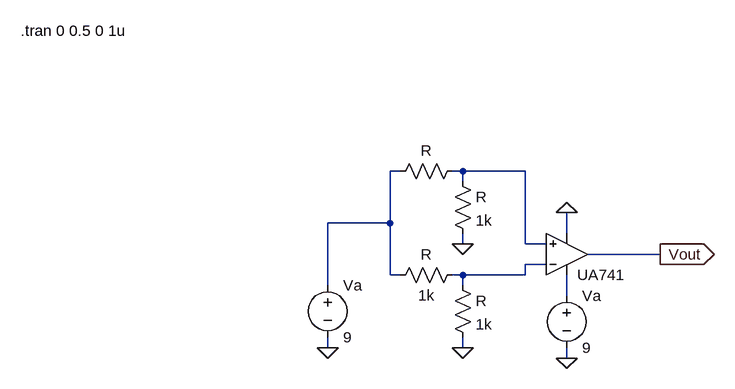
[diagram p0: schematic progetto_rete_termistore.asc]
progetto_rete_termistore.asc, the LTspice schematic file:
Version 4
SHEET 1 880 680
WIRE 32 96 16 96
WIRE 128 96 112 96
WIRE 224 96 128 96
WIRE 128 112 128 96
WIRE 16 176 16 96
WIRE 16 176 -80 176
WIRE 288 192 288 160
WIRE 128 208 128 192
WIRE 224 208 224 96
WIRE 256 208 224 208
WIRE 432 224 320 224
WIRE 256 240 224 240
WIRE 16 256 16 176
WIRE 32 256 16 256
WIRE 128 256 112 256
WIRE 224 256 224 240
WIRE 224 256 128 256
WIRE -80 272 -80 176
WIRE 128 272 128 256
WIRE 288 288 288 256
WIRE -80 368 -80 352
WIRE 128 368 128 352
WIRE 288 384 288 368
FLAG -80 368 0
FLAG 128 368 0
FLAG 128 208 0
FLAG 288 384 0
FLAG 288 160 0
FLAG 432 224 Vout
IOPIN 432 224 Out
SYMBOL res 128 80 R90
WINDOW 0 0 56 VBottom 2
WINDOW 3 32 56 VTop 2
SYMATTR InstName R
SYMATTR Value ""
SYMBOL res 112 96 R0
SYMATTR InstName R
SYMATTR Value 1k
SYMBOL res 112 256 R0
SYMATTR InstName R
SYMATTR Value 1k
SYMBOL res 128 240 R90
WINDOW 0 0 56 VBottom 2
WINDOW 3 32 56 VTop 2
SYMATTR InstName R
SYMATTR Value 1k
SYMBOL OpAmps\\UniversalOpAmp2 288 224 M180
SYMATTR InstName UA741
SYMBOL voltage 288 272 R0
WINDOW 123 0 0 Left 0
WINDOW 39 0 0 Left 0
SYMATTR InstName Va
SYMATTR Value 9
SYMBOL voltage -80 256 R0
WINDOW 123 0 0 Left 0
WINDOW 39 0 0 Left 0
SYMATTR InstName Va
SYMATTR Value 9
TEXT -552 -120 Left 2 !.tran 0 0.5 0 1u

The netlist it stands for:
* progetto_rete_termistore.asc
R N002 N001
R N002 0 1k
R N003 0 1k
R N003 N001 1k
XUA741 N002 N003 N004 0 Vout level2 Avol=1Meg GBW=10Meg Slew=10Meg Ilimit=25m Rail=0 Vos=0 En=0 Enk=0 In=0 Ink=0 Rin=500Meg  ; pins In+ In- V+ V- OUT
Va N004 0 9
Va N001 0 9
.tran 0 0.5 0 1u
.lib UniversalOpAmp2.lib
.backanno
.end